# Altium project PCB_SBW_Feedback_Reg.PrjPcb
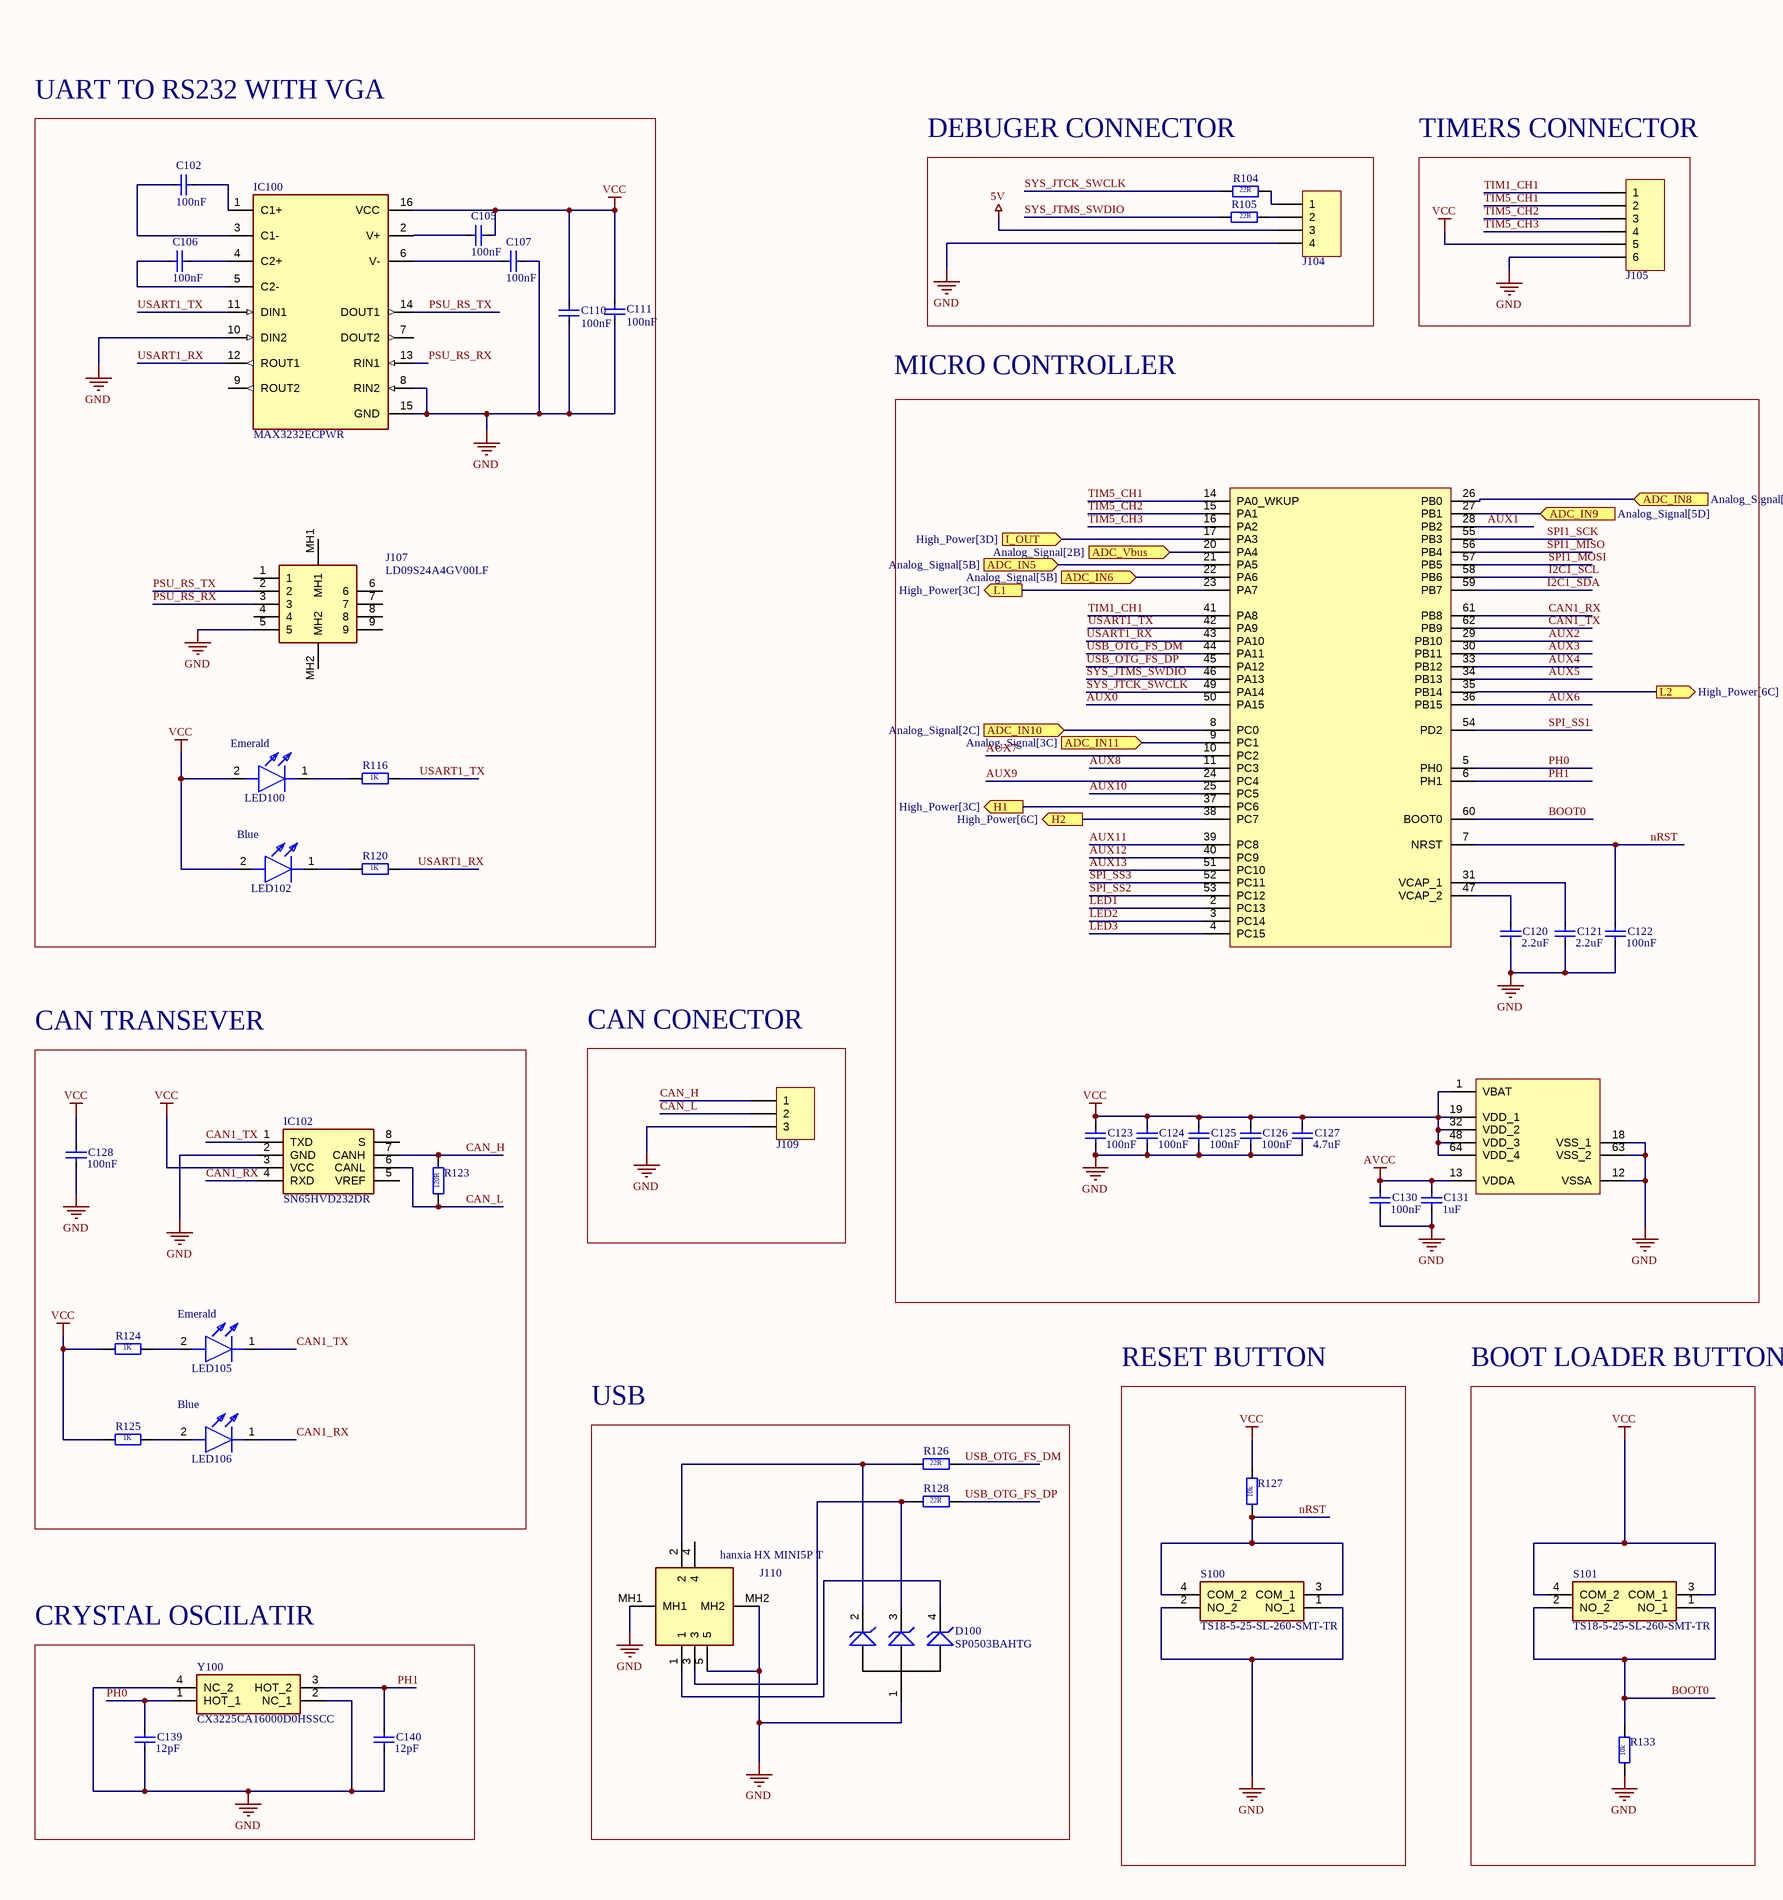
[diagram p0: Microcontroller.SchDoc, left]
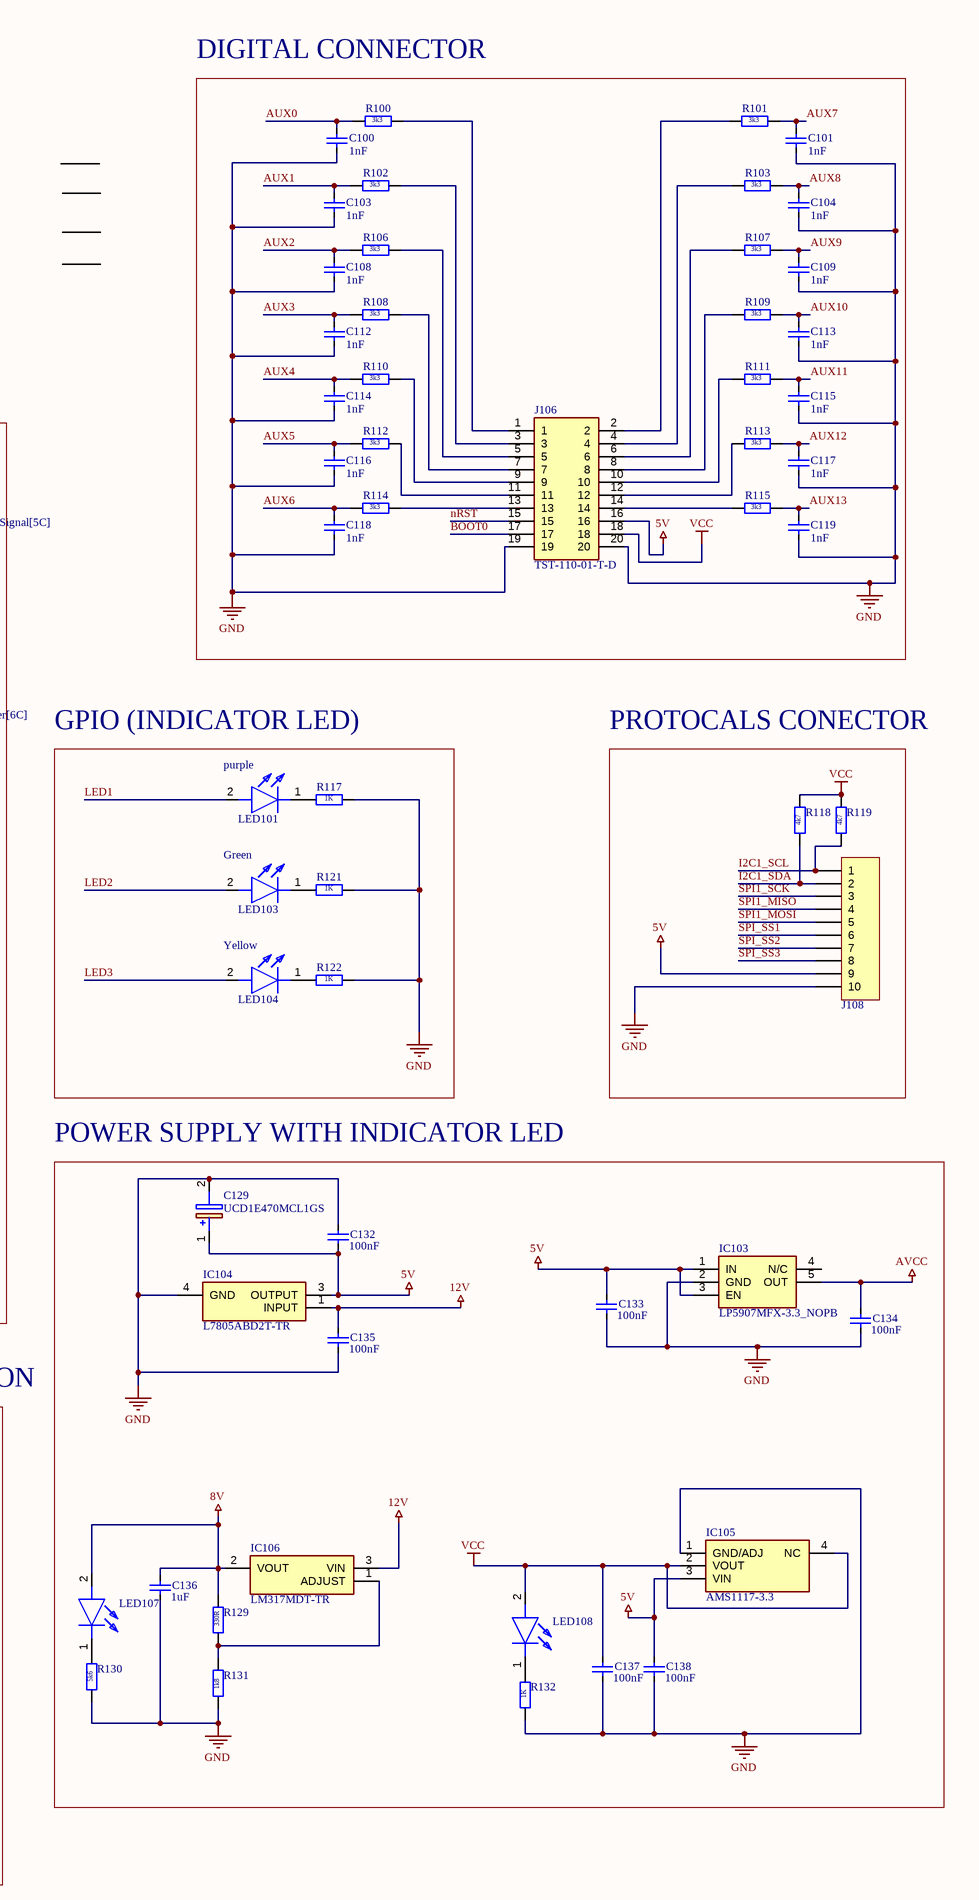
[diagram p1: Microcontroller.SchDoc, right]
3 sheets, 171 parts. Net scope: flat (ports and power ports of the same name join across sheets).
Board file: PCB_SBW_Feedback_Reg.PcbDoc
Sheets:
  Microcontroller.SchDoc
  Analog_Signal.SchDoc
  High_Power.SchDoc

## Sheet Microcontroller.SchDoc
size 594 x 420 mm; SheetNumber: 1; SheetTotal: 3

### Parts
C100  value 1nF  [CAPC1608X09N]  (hidden comment: C)
C101  value 1nF  [CAPC1608X09N]  (hidden comment: C)
C102  value 100nF  [CAPC1608X09N]  (hidden comment: C)
C103  value 1nF  [CAPC1608X09N]  (hidden comment: C)
C104  value 1nF  [CAPC1608X09N]  (hidden comment: C)
C105  value 100nF  [CAPC1608X09N]  (hidden comment: C)
C106  value 100nF  [CAPC1608X09N]  (hidden comment: C)
C107  value 100nF  [CAPC1608X09N]  (hidden comment: C)
C108  value 1nF  [CAPC1608X09N]  (hidden comment: C)
C109  value 1nF  [CAPC1608X09N]  (hidden comment: C)
C110  value 100nF  [CAPC1608X09N]  (hidden comment: C)
C111  value 100nF  [CAPC1608X09N]  (hidden comment: C)
C112  value 1nF  [CAPC1608X09N]  (hidden comment: C)
C113  value 1nF  [CAPC1608X09N]  (hidden comment: C)
C114  value 1nF  [CAPC1608X09N]  (hidden comment: C)
C115  value 1nF  [CAPC1608X09N]  (hidden comment: C)
C116  value 1nF  [CAPC1608X09N]  (hidden comment: C)
C117  value 1nF  [CAPC1608X09N]  (hidden comment: C)
C118  value 1nF  [CAPC1608X09N]  (hidden comment: C)
C119  value 1nF  [CAPC1608X09N]  (hidden comment: C)
C120  value 2.2uF  [CAPC1608X09N]  (hidden comment: C)
C121  value 2.2uF  [CAPC1608X09N]  (hidden comment: C)
C122  value 100nF  [CAPC1608X09N]  (hidden comment: C)
C123  value 100nF  [CAPC1608X09N]  (hidden comment: C)
C124  value 100nF  [CAPC1608X09N]  (hidden comment: C)
C125  value 100nF  [CAPC1608X09N]  (hidden comment: C)
C126  value 100nF  [CAPC1608X09N]  (hidden comment: C)
C127  value 4.7uF  [CAPC3216X18N]  (hidden comment: C)
C128  value 100nF  [CAPC1608X09N]  (hidden comment: C)
C129  UCD1E470MCL1GS  [CAPAE660X610N]
C130  value 100nF  [CAPC1608X09N]  (hidden comment: C)
C131  value 1uF  [CAPC1608X09N]  (hidden comment: C)
C132  value 100nF  [CAPC1608X09N]  (hidden comment: C)
C133  value 100nF  [CAPC1608X09N]  (hidden comment: C)
C134  value 100nF  [CAPC1608X09N]  (hidden comment: C)
C135  value 100nF  [CAPC1608X09N]  (hidden comment: C)
C136  value 1uF  [CAPC1608X09N]  (hidden comment: C)
C137  value 100nF  [CAPC1608X09N]  (hidden comment: C)
C138  value 100nF  [CAPC1608X09N]  (hidden comment: C)
C139  value 12pF  [CAPC1608X09N]  (hidden comment: C)
C140  value 12pF  [CAPC1608X09N]  (hidden comment: C)
D100  SP0503BAHTG  [SP0503BAHTG]
IC100  MAX3232ECPWR  [SOP65P640X120-16N]
IC101  STM32F405RGT6  [QFP50P1200X1200X160-64N]  (value not drawn)  (parts A,B of 2)
IC102  SN65HVD232DR  [SOIC127P600X175-8N]
IC103  LP5907MFX-3.3_NOPB  [SOT95P280X145-5N]
IC104  L7805ABD2T-TR  [D2PAK-STB35NF10T4]
IC105  AMS1117-3.3  [SOT229P700X180-4N]
IC106  LM317MDT-TR  [STD70N10F4]
J100  Hole  [Hole]  (value not drawn)  (no BOM)
J101  Hole  [Hole]  (value not drawn)  (no BOM)
J102  Hole  [Hole]  (value not drawn)  (no BOM)
J103  Hole  [Hole]  (value not drawn)  (no BOM)
J104  XH2.54-4P  [XH2.54-4P]  (value not drawn)
J105  XH2.54-6P  [XH2.54-6P]  (value not drawn)
J106  TST-110-01-T-D  [TST-110-XX-Y-D]
J107  LD09S24A4GV00LF  [LD09S24A4GV00LF]
J108  XH2.54-10P  [XH2.54-10P]  (value not drawn)
J109  XH2.54-3P  [XH2.54-3P]  (value not drawn)
J110  hanxia HX MINI5P T  [10119313301TLF]
LED100  Emerald  [LEDC1608X80N]
LED101  purple  [LEDC1608X80N]
LED102  Blue  [LEDC1608X80N]
LED103  Green  [LEDC1608X80N]
LED104  Yellow  [LEDC1608X80N]
LED105  Emerald  [LEDC1608X80N]
LED106  Blue  [LEDC1608X80N]
LED107  LTST-C190KGKT  [LEDC1608X80N]  (value not drawn)
LED108  LTST-C190KGKT  [LEDC1608X80N]  (value not drawn)
R100  value 3k3  [RESC1608X06N]  (hidden comment: R)
R101  value 3k3  [RESC1608X06N]  (hidden comment: R)
R102  value 3k3  [RESC1608X06N]  (hidden comment: R)
R103  value 3k3  [RESC1608X06N]  (hidden comment: R)
R104  value 22R  [RESC1608X06N]  (hidden comment: R)
R105  value 22R  [RESC1608X06N]  (hidden comment: R)
R106  value 3k3  [RESC1608X06N]  (hidden comment: R)
R107  value 3k3  [RESC1608X06N]  (hidden comment: R)
R108  value 3k3  [RESC1608X06N]  (hidden comment: R)
R109  value 3k3  [RESC1608X06N]  (hidden comment: R)
R110  value 3k3  [RESC1608X06N]  (hidden comment: R)
R111  value 3k3  [RESC1608X06N]  (hidden comment: R)
R112  value 3k3  [RESC1608X06N]  (hidden comment: R)
R113  value 3k3  [RESC1608X06N]  (hidden comment: R)
R114  value 3k3  [RESC1608X06N]  (hidden comment: R)
R115  value 3k3  [RESC1608X06N]  (hidden comment: R)
R116  value 1K  [RESC1608X06N]  (hidden comment: R)
R117  value 1K  [RESC1608X06N]  (hidden comment: R)
R118  value 4k7  [RESC3216X07N]  (hidden comment: R)
R119  value 4k7  [RESC3216X07N]  (hidden comment: R)
R120  value 1K  [RESC1608X06N]  (hidden comment: R)
R121  value 1K  [RESC1608X06N]  (hidden comment: R)
R122  value 1K  [RESC1608X06N]  (hidden comment: R)
R123  value 120R  [RESC1608X06N]  (hidden comment: R)
R124  value 1K  [RESC1608X06N]  (hidden comment: R)
R125  value 1K  [RESC1608X06N]  (hidden comment: R)
R126  value 22R  [RESC1608X06N]  (hidden comment: R)
R127  value 10k  [RESC1608X06N]  (hidden comment: R)
R128  value 22R  [RESC1608X06N]  (hidden comment: R)
R129  value 330R  [RESC1608X06N]  (hidden comment: R)
R130  value 5k6  [RESC1608X06N]  (hidden comment: R)
R131  value 1k8  [RESC1608X06N]  (hidden comment: R)
R132  value 1K  [RESC1608X06N]  (hidden comment: R)
R133  value 10k  [RESC1608X06N]  (hidden comment: R)
S100  TS18-5-25-SL-260-SMT-TR  [TS18525SL260SMTTR]
S101  TS18-5-25-SL-260-SMT-TR  [TS18525SL260SMTTR]
Y100  CX3225CA16000D0HSSCC  [CX3225CA16000D0HSSCC]

### Blocks framed on the sheet
DIGITAL CONNECTOR: C100 C101 C103 C104 C108 C109 C112-C119 J106 R100-R103 R106-R115
UART TO RS232 WITH VGA: C102 C105-C107 C110 C111 IC100 J107 LED100 LED102 R116 R120
DEBUGER CONNECTOR: J104 R104 R105
TIMERS CONNECTOR: J105
MICRO CONTROLLER: C120-C127 C130 C131 IC101
GPIO (INDICATOR LED): LED101 LED103 LED104 R117 R121 R122
PROTOCALS CONECTOR: J108 R118 R119
CAN TRANSEVER: C128 IC102 LED105 LED106 R123-R125
CAN CONECTOR: J109
POWER SUPPLY WITH INDICATOR LED: C129 C132-C138 IC103-IC106 LED107 LED108 R129-R132
RESET BUTTON: R127 S100
BOOT LOADER BUTTON: R133 S101
USB: D100 J110 R126 R128
CRYSTAL OSCILATIR: C139 C140 Y100

### Ports
ADC_IN5 (in, see Analog_Signal[5B]), ADC_IN6 (in, see Analog_Signal[5B]), ADC_IN8 (in, see Analog_Signal[5C]), ADC_IN9 (in, see Analog_Signal[5D]), ADC_IN10 (in, see Analog_Signal[2C]), ADC_IN11 (in, see Analog_Signal[3C]), ADC_Vbus (in, see Analog_Signal[2B]), H1 (out, see High_Power[3C]), H2 (out, see High_Power[6C]), I_OUT (in, see High_Power[3D]), L1 (out, see High_Power[3C]), L2 (out, see High_Power[6C])

### Nets
5V: C129.1(+) C132.1 C133.2 C138.2 IC103.1(IN) IC103.3(EN) IC104.3(OUTPUT) IC105.3(VIN) J104.3 J106.16 J108.9
8V: C136.2 IC106.2(VOUT) LED107.2(A) R129.2
12V: C135.2 IC104.1(INPUT) IC106.3(VIN)
AVCC: C130.2 C131.2 C134.2 IC101.13(VDDA) IC103.5(OUT)
GND: C100.1 C101.1 C103.1 C104.1 C107.1 C108.1 C109.1 C110.2 C111.2 C112.1 C113.1 C114.1 C115.1 C116.1 C117.1 C118.1 C119.1 C120.1 C121.1 C122.1 C123.1 C124.1 C125.1 C126.1 C127.1 C128.1 C129.2(-) C130.1 C131.1 C132.2 C133.1 C134.1 C135.1 C136.1 C137.1 C138.1 C139.1 C140.1 D100.1(COMMON_A) IC100.8(RIN2) IC100.10(DIN2) IC100.15(GND) IC101.12(VSSA) IC101.18(VSS_1) IC101.63(VSS_2) IC102.2(GND) IC103.2(GND) IC104.4(GND) IC105.1(GND/ADJ) J104.4 J105.6 J106.19 J106.20 J107.5 J108.10 J109.3 J110.5 J110.MH1 J110.MH2 R117.2 R121.2 R122.2 R130.1 R131.1 R132.1 R133.1 S100.1(NO_1) S100.2(NO_2) Y100.2(NC_1) Y100.4(NC_2)
VCC: C105.1 C110.1 C111.1 C123.2 C124.2 C125.2 C126.2 C127.2 C128.2 C137.2 IC100.16(VCC) IC101.1(VBAT) IC101.19(VDD_1) IC101.32(VDD_2) IC101.48(VDD_3) IC101.64(VDD_4) IC102.3(VCC) IC105.2(VOUT) IC105.4(NC) J105.5 J106.18 LED100.2(A) LED102.2(A) LED108.2(A) R118.2 R119.2 R124.1 R125.1 R127.2 S101.3(COM_1) S101.4(COM_2)
AUX0: C100.2 IC101.50(PA15) R100.1
AUX1: C103.2 IC101.28(PB2) R102.1
AUX2: C108.2 IC101.29(PB10) R106.1
AUX3: C112.2 IC101.30(PB11) R108.1
AUX4: C114.2 IC101.33(PB12) R110.1
AUX5: C116.2 IC101.34(PB13) R112.1
AUX6: C118.2 IC101.36(PB15) R114.1
AUX7: C101.2 IC101.10(PC2) R101.1
AUX8: C104.2 IC101.11(PC3) R103.1
AUX9: C109.2 IC101.24(PC4) R107.1
AUX10: C113.2 IC101.25(PC5) R109.1
AUX11: C115.2 IC101.39(PC8) R111.1
AUX12: C117.2 IC101.40(PC9) R113.1
AUX13: C119.2 IC101.51(PC10) R115.1
BOOT0: IC101.60(BOOT0) J106.17 R133.2 S101.1(NO_1) S101.2(NO_2)
CAN1_RX: IC101.61(PB8) IC102.4(RXD) LED106.1(K)
CAN1_TX: IC101.62(PB9) IC102.1(TXD) LED105.1(K)
CAN_H: IC102.7(CANH) J109.1 R123.2
CAN_L: IC102.6(CANL) J109.2 R123.1
I2C1_SCL: IC101.58(PB6) J108.1 R119.1
I2C1_SDA: IC101.59(PB7) J108.2 R118.1
LED1: IC101.2(PC13) LED101.2(A)
LED2: IC101.3(PC14) LED103.2(A)
LED3: IC101.4(PC15) LED104.2(A)
nRST: C122.2 IC101.7(NRST) J106.15 R127.1 S100.3(COM_1) S100.4(COM_2)
PH0: C139.2 IC101.5(PH0) Y100.1(HOT_1)
PH1: C140.2 IC101.6(PH1) Y100.3(HOT_2)
PSU_RS_RX: IC100.13(RIN1) J107.3
PSU_RS_TX: IC100.14(DOUT1) J107.2
SPI1_MISO: IC101.56(PB4) J108.4
SPI1_MOSI: IC101.57(PB5) J108.5
SPI1_SCK: IC101.55(PB3) J108.3
SPI_SS1: IC101.54(PD2) J108.6
SPI_SS2: IC101.53(PC12) J108.7
SPI_SS3: IC101.52(PC11) J108.8
SYS_JTCK_SWCLK: IC101.49(PA14) R104.1
SYS_JTMS_SWDIO: IC101.46(PA13) R105.1
TIM1_CH1: IC101.41(PA8) J105.1
TIM5_CH1: IC101.14(PA0_WKUP) J105.2
TIM5_CH2: IC101.15(PA1) J105.3
TIM5_CH3: IC101.16(PA2) J105.4
USART1_RX: IC100.12(ROUT1) IC101.43(PA10) R120.2
USART1_TX: IC100.11(DIN1) IC101.42(PA9) R116.2
USB_OTG_FS_DM: IC101.44(PA11) R126.2
USB_OTG_FS_DP: IC101.45(PA12) R128.2
NetC102_1: C102.1 IC100.1(C1+)
NetC102_2: C102.2 IC100.3(C1-)
NetC105_2: C105.2 IC100.2(V+)
NetC106_1: C106.1 IC100.4(C2+)
NetC106_2: C106.2 IC100.5(C2-)
NetC107_2: C107.2 IC100.6(V-)
NetC120_2: C120.2 IC101.47(VCAP_2)
NetC121_2: C121.2 IC101.31(VCAP_1)
NetC200_2: IC101.20(PA4) ; port ADC_Vbus
NetC205_2: IC101.8(PC0) ; port ADC_IN10
NetC206_2: IC101.9(PC1) ; port ADC_IN11
NetC309_1: IC101.17(PA3) ; port I_OUT
NetD100_2: D100.2(K_1) J110.2 R126.1
NetD100_3: D100.3(K_2) J110.3 R128.1
NetD100_4: D100.4(K_3) J110.1
NetIC101_21: IC101.21(PA5) ; port ADC_IN5
NetIC101_22: IC101.22(PA6) ; port ADC_IN6
NetIC101_23: IC101.23(PA7) ; port L1
NetIC101_26: IC101.26(PB0) ; port ADC_IN8
NetIC101_27: IC101.27(PB1) ; port ADC_IN9
NetIC101_35: IC101.35(PB14) ; port L2
NetIC101_37: IC101.37(PC6) ; port H1
NetIC101_38: IC101.38(PC7) ; port H2
NetIC106_1: IC106.1(ADJUST) R129.1 R131.2
NetJ104_1: J104.1 R104.2
NetJ104_2: J104.2 R105.2
NetJ106_1: J106.1 R100.2
NetJ106_2: J106.2 R101.2
NetJ106_3: J106.3 R102.2
NetJ106_4: J106.4 R103.2
NetJ106_5: J106.5 R106.2
NetJ106_6: J106.6 R107.2
NetJ106_7: J106.7 R108.2
NetJ106_8: J106.8 R109.2
NetJ106_9: J106.9 R110.2
NetJ106_10: J106.10 R111.2
NetJ106_11: J106.11 R112.2
NetJ106_12: J106.12 R113.2
NetJ106_13: J106.13 R114.2
NetJ106_14: J106.14 R115.2
NetLED100_1: LED100.1(K) R116.1
NetLED101_1: LED101.1(K) R117.1
NetLED102_1: LED102.1(K) R120.1
NetLED103_1: LED103.1(K) R121.1
NetLED104_1: LED104.1(K) R122.1
NetLED105_2: LED105.2(A) R124.2
NetLED106_2: LED106.2(A) R125.2
NetLED107_1: LED107.1(K) R130.2
NetLED108_1: LED108.1(K) R132.2

Not connected (* = marked no-connect by the designer): IC100 7(DOUT2) 9(ROUT2); IC102 5(VREF) 8(S); IC103 4(N/C); J100 J?(0); J101 J?(0); J102 J?(0); J103 J?(0); J107 1 4 6 7 8 9 MH1 MH2; J110 4

### Notes on the sheet
- DWG NO:
- REV:
- THIS DOCUMENT AND THE DATA DISCLOSED HEREIN OR
- HEREWITH IS THE PROPERTY OF ALTIUM LIMITED AND MAY
- BE FREELY DISTRIBUTED IN WHOLE. NO RIGHTS ARE
- RESERVED OR EXPRESS OR IMPLIED WARANTEE GIVEN.
- REVISION
- DESCRIPTION
- DATE
- APPROVED
- ENG:
- APPROVALS
- PROJECT
- DSN:
- CHK:
- REFERENCE DOCUMENTS
- PROJECT REVISION:
- TITLE
- DOCUMENT REVISION:
- DESIGN ITEM:
- BOM:
- FAB DWG:
- PCB DWG:
- ASSY DWG:
- SCALE:
- A2
- SIZE
- CAGE CODE
- FILE NAME
- DWG NO.
- SHEET
- OF
- REV

### Library data of the parts
C100 C101 C103 C104 C108 C109 C112-C119 = C: MPN: CC0603KRX7R9BB102; Link: https://www.lcsc.com/product-detail/Multilayer-Ceramic-Capacitors-MLCC-SMD-SMT_YAGEO-CC0603KRX7R9BB102_C100040.html?s_z=n_CC0603KRX7R9BB102
C102 C105-C107 C110 C111 C122-C126 C128 C130 C132-C135 C137 C138 = C: MPN: 06033C104KAT4A; Link: https://www.lcsc.com/product-detail/Multilayer-Ceramic-Capacitors-MLCC-SMD-SMT_Kyocera-AVX-06033C104KAT4A_C2167104.html
C120 C121 = C: MPN: 0603B225K250NT; Link: https://www.lcsc.com/product-detail/Multilayer-Ceramic-Capacitors-MLCC-SMD-SMT_FH-Guangdong-Fenghua-Advanced-Tech-0603B225K250NT_C99228.html?s_z=n_0603B225K250NT
C127 = C: MPN: CS3216X7R475K160NRI; Link: https://www.lcsc.com/search?q=CS3216X7R475K160NRI&s_z=n_CS3216X7R475K160NRI
C129 = UCD1E470MCL1GS: Capacitor Polarised; Manufacturer_Name: Nichicon; Datasheet Link: https://www.lcsc.com/datasheet/lcsc_datasheet_2410121340_Nichicon-UCD1E470MCL1GS_C308827.pdf; Height: 6.1mm; MPN: UCD1E470MCL1GS; LCSC Part Number: C308827; LCSC Price/Stock: https://www.lcsc.com/product-detail/Aluminum-Electrolytic-Capacitors-SMD_Nichicon-UCD1E470MCL1GS_C308827.html?s_z=n_UCD1E470MCL1GS; Arrow Part Number: UCD1E470MCL1GS; Link: https://www.lcsc.com/product-detail/Aluminum-Electrolytic-Capacitors-SMD_Nichicon-UCD1E470MCL1GS_C308827.html?s_z=n_UCD1E470MCL1GS
C131 C136 = C: MPN: CL10B105KP8NNNC; Link: https://www.lcsc.com/search?q=CL10B105KP8NNNC&s_z=n_CL10B105KP8NNNC
C139 C140 = C: MPN: CL10C120JB8NNNC; Link: https://www.lcsc.com/product-detail/Multilayer-Ceramic-Capacitors-MLCC-SMD-SMT_Samsung-Electro-Mechanics-CL10C120JB8NNNC_C38523.html
D100 = SP0503BAHTG: TVS Diode (Uni-directional); Manufacturer_Name: GOODWORK; Datasheet Link: https://nl.mouser.com/datasheet/2/240/Littelfuse_TVS_Diode_Array_SP05_Datasheet.pdf-777043.pdf; Height: 1.22mm; MPN: SP0503BAHTG; LCSC Part Number: C41364459; LCSC Price/Stock: https://www.lcsc.com/product-detail/ESD-and-Surge-Protection-TVS-ESD_GOODWORK-SP0503BAHTG_C41364459.html?s_z=n_SP0503BAHTG; Arrow Part Number: SP0503BAHTG; Link: https://www.lcsc.com/product-detail/ESD-and-Surge-Protection-TVS-ESD_GOODWORK-SP0503BAHTG_C41364459.html?s_z=n_SP0503BAHTG
IC100 = MAX3232ECPWR: Integrated Circuit; Manufacturer_Name: Texas Instruments; Datasheet Link: http://www.ti.com/general/docs/lit/getliterature.tsp?genericPartNumber=MAX3232E&fileType=pdf&HQS=ti-null-null-sf-df-pf-sep-wwe&DCM=yes; Height: 1.2mm; MPN: MAX3232ECPWR; LCSC Part Number: C11317; LCSC Price/Stock: https://www.lcsc.com/product-detail/RS232-ICs_Texas-Instruments-MAX3232ECPWR_C11317.html?s_z=n_MAX3232ECPWR; Arrow Part Number: MAX3232ECPWR; Link: https://www.lcsc.com/product-detail/RS232-ICs_Texas-Instruments-MAX3232ECPWR_C11317.html?s_z=n_MAX3232ECPWR
IC101 = STM32F405RGT6: Integrated Circuit; Manufacturer_Name: STMicroelectronics; Datasheet Link: http://www.st.com/web/en/resource/technical/document/datasheet/DM00037051.pdf; Height: 1.6mm; MPN: STM32F405RGT6; LCSC Part Number: C15742; LCSC Price/Stock: https://www.lcsc.com/product-detail/Microcontrollers-MCU-MPU-SOC_STMicroelectronics-STM32F405RGT6_C15742.html?s_z=n_Stm32f405rg; Arrow Part Number: STM32F405RGT6; Link: https://www.lcsc.com/product-detail/Microcontrollers-MCU-MPU-SOC_STMicroelectronics-STM32F405RGT6_C15742.html?s_z=n_Stm32f405rg
IC102 = TJA1050T_CM: Integrated Circuit; Manufacturer_Name: NXP; Datasheet Link: https://www.lcsc.com/datasheet/lcsc_datasheet_2410010302_Texas-Instruments-SN65HVD232DR_C30530.pdf; Height: 1.75mm; MPN: SN65HVD232DR; LCSC Part Number: C30530; LCSC Price/Stock: https://www.lcsc.com/product-detail/CAN-Transceivers_Texas-Instruments-SN65HVD232DR_C30530.html?s_z=n_SN65HVD232DR; Link: https://www.lcsc.com/product-detail/CAN-Transceivers_Texas-Instruments-SN65HVD232DR_C30530.html?s_z=n_SN65HVD232DR
IC103 = LP5907MFX-3.3_NOPB: Integrated Circuit; Manufacturer_Name: Texas Instruments; MPN: LP5907MFX-3.3/NOPB; Datasheet Link: https://www.lcsc.com/datasheet/lcsc_datasheet_1810271029_Texas-Instruments-LP5907MFX-3-3-NOPB_C80670.pdf; Height: 1.45mm; LCSC Part Number: C80670; LCSC Price/Stock: https://www.lcsc.com/product-detail/Voltage-Regulators-Linear-Low-Drop-Out-LDO-Regulators_Texas-Instruments-LP5907MFX-3-3-NOPB_C80670.html?s_z=n_LP5907MFX-3.3%2FNOPB; Arrow Part Number: LP5907MFX-3.3/NOPB; Link: https://www.lcsc.com/product-detail/Voltage-Regulators-Linear-Low-Drop-Out-LDO-Regulators_Texas-Instruments-LP5907MFX-3-3-NOPB_C80670.html?s_z=n_LP5907MFX-3.3%2FNOPB
IC104 = L7805ABD2T-TR: Integrated Circuit; Manufacturer_Name: STMicroelectronics; Datasheet Link: https://www.lcsc.com/datasheet/lcsc_datasheet_2212141130_STMicroelectronics-L7805ABD2T-TR_C86206.pdf; MPN: L7805ABD2T-TR; LCSC Part Number: C86206; LCSC Price/Stock: https://www.lcsc.com/product-detail/Voltage-Regulators-Linear-Low-Drop-Out-LDO-Regulators_STMicroelectronics-L7805ABD2T-TR_C86206.html?s_z=n_L7805ABD2T-TR; Arrow Part Number: L7805ABD2T-TR; Link: https://www.lcsc.com/product-detail/Voltage-Regulators-Linear-Low-Drop-Out-LDO-Regulators_STMicroelectronics-L7805ABD2T-TR_C86206.html?s_z=n_L7805ABD2T-TR
IC105 = AMS1117-3.3: Integrated Circuit; Manufacturer_Name: Advanced; Datasheet Link: https://www.lcsc.com/datasheet/lcsc_datasheet_2412201207_UMW-Youtai-Semiconductor-Co---Ltd--AMS1117-3-3_C347222.pdf; Height: 1.8mm; MPN: AMS1117-3.3; LCSC Part Number: C347222; LCSC Price/Stock: https://www.lcsc.com/product-detail/Voltage-Regulators-Linear-Low-Drop-Out-LDO-Regulators_UMW-Youtai-Semiconductor-Co-Ltd-AMS1117-3-3_C347222.html?s_z=n_AMS1117-3.3; Link: https://www.lcsc.com/product-detail/Voltage-Regulators-Linear-Low-Drop-Out-LDO-Regulators_UMW-Youtai-Semiconductor-Co-Ltd-AMS1117-3-3_C347222.html?s_z=n_AMS1117-3.3
IC106 = LM317MDT-TR: Integrated Circuit; Manufacturer_Name: STMicroelectronics; Datasheet Link: https://www.lcsc.com/datasheet/lcsc_datasheet_1811151523_STMicroelectronics-LM317MDT-TR_C68136.pdf; Height: 2.4mm; MPN: LM317MDT-TR; LCSC Part Number: C68136; LCSC Price/Stock: https://www.lcsc.com/product-detail/Voltage-Regulators-Linear-Low-Drop-Out-LDO-Regulators_STMicroelectronics-LM317MDT-TR_C68136.html?s_z=n_lm317; Arrow Part Number: LM317MDT-TR; Arrow Price/Stock: https://www.arrow.com/en/products/lm317mdt-tr/stmicroelectronics?utm_currency=USD&region=nac; Link: https://www.lcsc.com/product-detail/Voltage-Regulators-Linear-Low-Drop-Out-LDO-Regulators_STMicroelectronics-LM317MDT-TR_C68136.html?s_z=n_lm317
J104 = XH2.54-4P: MPN: BX-XH2.54-4PZZ; Link: https://www.lcsc.com/product-detail/Wire-To-Board-Connector_Bossie-BX-XH2-54-4PZZ_C18077835.html?s_z=n_BX-XH2.54-4PZZ
J105 = XH2.54-6P: MPN: BX-XH2.54-6PZZ; Link: https://www.lcsc.com/product-detail/Wire-To-Board-Connector_Bossie-BX-XH2-54-6PZZ_C18077837.html?s_z=n_BX-XH2.54-6PZZ
J106 = TST-110-01-T-D: Connector; Manufacturer_Name: SAMTEC; MPN: BH254V-20P; Datasheet Link: http://suddendocs.samtec.com/prints/tst-1xx-xx-x-x-xx-xx-mkt.pdf; LCSC Part Number: C492444; LCSC Price/Stock: https://www.lcsc.com/product-detail/IDC-Connectors_XFCN-BH254V-20P_C492444.html; Arrow Part Number: TST-110-01-T-D; Link: https://www.lcsc.com/product-detail/IDC-Connectors_XFCN-BH254V-20P_C492444.html
J107 = LD09S24A4GV00LF: Connector; Manufacturer_Name: Amphenol Communications Solutions; MPN: DS1034-09FUNSi44; Datasheet Link: https://www.lcsc.com/datasheet/lcsc_datasheet_2501031530_CONNFLY-Elec-DS1034-09FUNSi44_C77831.pdf; Height: 12.39mm; LCSC Part Number: C77831; Arrow Part Number: LD09S24A4GV00LF; Link: https://www.lcsc.com/product-detail/D-Sub-VGA-Connectors_CONNFLY-Elec-DS1034-09FUNSi44_C77831.html
J108 = XH2.54-10P: MPN: BX-XH2.54-10PZZ; Link: https://www.lcsc.com/product-detail/Wire-To-Board-Connector_Bossie-BX-XH2-54-10PZZ_C18077841.html?s_z=n_XH2.54-10P
J109 = XH2.54-3P: MPN: BX-XH2.54-3PZZ; Link: https://www.lcsc.com/product-detail/Wire-To-Board-Connector_Bossie-BX-XH2-54-3PZZ_C18077834.html?s_z=n_BX-XH2.54-3PZZ
J110 = 10119313-301TLF: Connector; Datasheet Link: https://www.lcsc.com/datasheet/lcsc_datasheet_2311032126_hanxia-HX-MINI5P-T_C19189146.pdf; Height: 9.7mm; Manufacturer_Name: hanxia; MPN: HX MINI5P T; LCSC Part Number: C19189146; LCSC Price/Stock: https://www.lcsc.com/product-detail/USB-Connectors_hanxia-HX-MINI5P-T_C19189146.html; Link: https://www.lcsc.com/product-detail/USB-Connectors_hanxia-HX-MINI5P-T_C19189146.html
LED100 LED105 = LTST-C190KGKT: LED; Manufacturer_Name: Lite-On; MPN: XL-1608UGC-04; Datasheet Link: https://www.lcsc.com/datasheet/lcsc_datasheet_2410121310_XINGLIGHT-XL-1608UGC-04_C965804.pdf; Height: 0.8mm; LCSC Part Number: C965804; LCSC Price/Stock: https://www.lcsc.com/product-detail/LED-Indication-Discrete_XINGLIGHT-XL-1608UGC-04_C965804.html; Arrow Part Number: LTST-C190KGKT; Arrow Price/Stock: https://www.arrow.com/en/products/ltst-c190kgkt/lite-on-technology?region=europe; Link: https://www.lcsc.com/product-detail/LED-Indication-Discrete_XINGLIGHT-XL-1608UGC-04_C965804.html
LED101 = LTST-C190KGKT: LED; Manufacturer_Name: XINGLIGHT; MPN: XL-1608UVC-04; Datasheet Link: https://www.lcsc.com/datasheet/lcsc_datasheet_2410121441_XINGLIGHT-XL-1608UVC-04_C7371898.pdf; Height: 0.8mm; Lcsc Part Number: C7371898; Lcsc Price/Stock: https://www.lcsc.com/product-detail/LED-Indication-Discrete_XINGLIGHT-XL-1608UVC-04_C7371898.html; Arrow Part Number: LTST-C190KGKT; Link: https://www.lcsc.com/product-detail/LED-Indication-Discrete_XINGLIGHT-XL-1608UVC-04_C7371898.html
LED102 LED106 = LTST-C190KGKT: LED; Manufacturer_Name: Lite-On; MPN: XL-1608UBC-04; Datasheet Link: https://www.lcsc.com/datasheet/lcsc_datasheet_2410121310_XINGLIGHT-XL-1608UBC-04_C965807.pdf; Height: 0.8mm; LCSC Part Number: C965807; LCSC Price/Stock: https://www.lcsc.com/product-detail/LED-Indication-Discrete_XINGLIGHT-XL-1608UBC-04_C965807.html; Arrow Part Number: LTST-C190KGKT; Arrow Price/Stock: https://www.arrow.com/en/products/ltst-c190kgkt/lite-on-technology?region=europe; Link: https://www.lcsc.com/product-detail/LED-Indication-Discrete_XINGLIGHT-XL-1608UBC-04_C965807.html
LED103 = LTST-C190KGKT: LED; Manufacturer_Name: XINGLIGHT; MPN: XL-1608BGWC-06; Datasheet Link: https://www.lcsc.com/datasheet/lcsc_datasheet_2410121258_XINGLIGHT-XL-1608BGWC-06_C965809.pdf; Height: 0.8mm; Lcsc Part Number: C965809; Lcsc Price/Stock: https://www.lcsc.com/product-detail/LED-Indication-Discrete_XINGLIGHT-XL-1608BGWC-06_C965809.html; Arrow Part Number: LTST-C190KGKT; Arrow Price/Stock: https://www.arrow.com/en/products/ltst-c190kgkt/lite-on-technology?region=europe; Link: https://www.lcsc.com/product-detail/LED-Indication-Discrete_XINGLIGHT-XL-1608BGWC-06_C965809.html
LED104 = LTST-C190KGKT: LED; Manufacturer_Name: XINGLIGHT; MPN: XL-1608WYC-06; Datasheet Link: https://www.lcsc.com/datasheet/lcsc_datasheet_2410121258_XINGLIGHT-XL-1608WYC-06_C7371907.pdf; Height: 0.8mm; Lcsc Part Number: C7371907; Lcsc Price/Stock: https://www.lcsc.com/product-detail/LED-Indication-Discrete_XINGLIGHT-XL-1608WYC-06_C7371907.html; Arrow Part Number: LTST-C190KGKT; Arrow Price/Stock: https://www.arrow.com/en/products/ltst-c190kgkt/lite-on-technology?region=europe; Link: https://www.lcsc.com/product-detail/LED-Indication-Discrete_XINGLIGHT-XL-1608WYC-06_C7371907.html
LED107 LED108 = LTST-C190KGKT: LED; Manufacturer_Name: XINGLIGHT; MPN: XL-1608SURC-06; Datasheet Link: https://www.lcsc.com/datasheet/lcsc_datasheet_2402181505_XINGLIGHT-XL-1608SURC-06_C965799.pdf; Height: 0.8mm; LCSC Part Number: C965799; LCSC Price/Stock: https://www.lcsc.com/product-detail/LED-Indication-Discrete_XINGLIGHT-XL-1608SURC-06_C965799.html; Arrow Part Number: LTST-C190KGKT; Arrow Price/Stock: https://www.arrow.com/en/products/ltst-c190kgkt/lite-on-technology?region=europe; Link: https://www.lcsc.com/product-detail/LED-Indication-Discrete_XINGLIGHT-XL-1608SURC-06_C965799.html
R100-R103 R106-R115 = R: MPN: 0603WAF3301T5E; Link: https://www.lcsc.com/product-detail/Chip-Resistor-Surface-Mount_UNI-ROYAL-Uniroyal-Elec-0603WAF3301T5E_C22978.html?s_z=n_0603WAF3301T5E
R104 R105 R126 R128 = R: MPN: 0603WAF220JT5E
  R104 R105: Link: https://www.lcsc.com/product-detail/Chip-Resistor-Surface-Mount_UNI-ROYAL-Uniroyal-Elec-0603WAF220JT5E_C23345.html?s_z=n_0603WAF220JT5E
  R126 R128: Link: https://www.lcsc.com/product-detail/Chip-Resistor-Surface-Mount_UNI-ROYAL-Uniroyal-Elec-0603WAF220JT5E_C23345.html
R116 R117 R120-R122 R124 R125 R132 = R: MPN: 0603WAF1001T5E; Link: https://www.lcsc.com/product-detail/Chip-Resistor-Surface-Mount_UNI-ROYAL-Uniroyal-Elec-0603WAF1001T5E_C21190.html
R118 R119 = R: MPN: RC0603FR-074K7L; Link: https://www.lcsc.com/product-detail/Chip-Resistor-Surface-Mount_YAGEO-RC0603FR-074K7L_C99782.html
R123 = R: MPN: 0603WAF1200T5E; Link: https://www.lcsc.com/product-detail/Chip-Resistor-Surface-Mount_UNI-ROYAL-Uniroyal-Elec-0603WAF1200T5E_C22787.html
R127 R133 = R: MPN: RC0603FR-0710KL; Link: https://www.lcsc.com/product-detail/Chip-Resistor-Surface-Mount_YAGEO-RC0603FR-0710KL_C98220.html
R129 = R: MPN: 0805W8F3300T5E; Link: https://www.lcsc.com/product-detail/Chip-Resistor-Surface-Mount_UNI-ROYAL-Uniroyal-Elec-0805W8F3300T5E_C17630.html?s_z=n_resistor
R130 = R: MPN: 0603WAF5601T5E; Link: https://www.lcsc.com/product-detail/Chip-Resistor-Surface-Mount_UNI-ROYAL-Uniroyal-Elec-0603WAF5601T5E_C23189.html
R131 = R: MPN: 0603WAF1801T5E; Link: https://www.lcsc.com/product-detail/Chip-Resistor-Surface-Mount_YAGEO-RC0603FR-0710KL_C98220.html
S100 S101 = TS18-5-25-SL-260-SMT-TR: Switch; Manufacturer_Name: G-Switch; MPN: GT-TC084B-H015-L5; Datasheet Link: https://www.lcsc.com/datasheet/lcsc_datasheet_2412091245_G-Switch-GT-TC084B-H015-L5_C778173.pdf; Height: 2.7mm; LCSC Part Number: C778173; LCSC Price/Stock: https://www.lcsc.com/product-detail/Tactile-Switches_G-Switch-GT-TC084B-H015-L5_C778173.html; Link: https://www.lcsc.com/product-detail/Tactile-Switches_G-Switch-GT-TC084B-H015-L5_C778173.html
Y100 = CX3225CA16000D0HSSCC: Crystal or Oscillator; Manufacturer_Name: YXC Crystal Oscillators; MPN: XL2EL89COI-111YLC-8M; Datasheet Link: https://www.lcsc.com/datasheet/lcsc_datasheet_2411121006_YXC-Crystal-Oscillators-XL2EL89COI-111YLC-8M_C2973805.pdf; Height: 0.9mm; LCSC Part Number: C2973805; LCSC Price/Stock: https://www.lcsc.com/product-detail/Crystals_YXC-Crystal-Oscillators-XL2EL89COI-111YLC-8M_C2973805.html; Arrow Part Number: CX3225CA16000D0HSSCC; Link: https://www.lcsc.com/product-detail/Crystals_YXC-Crystal-Oscillators-XL2EL89COI-111YLC-8M_C2973805.html
J100-J103 = Hole: Parameter 1: *

## Sheet Analog_Signal.SchDoc
size 594 x 420 mm; SheetNumber: 2; SheetTotal: 3
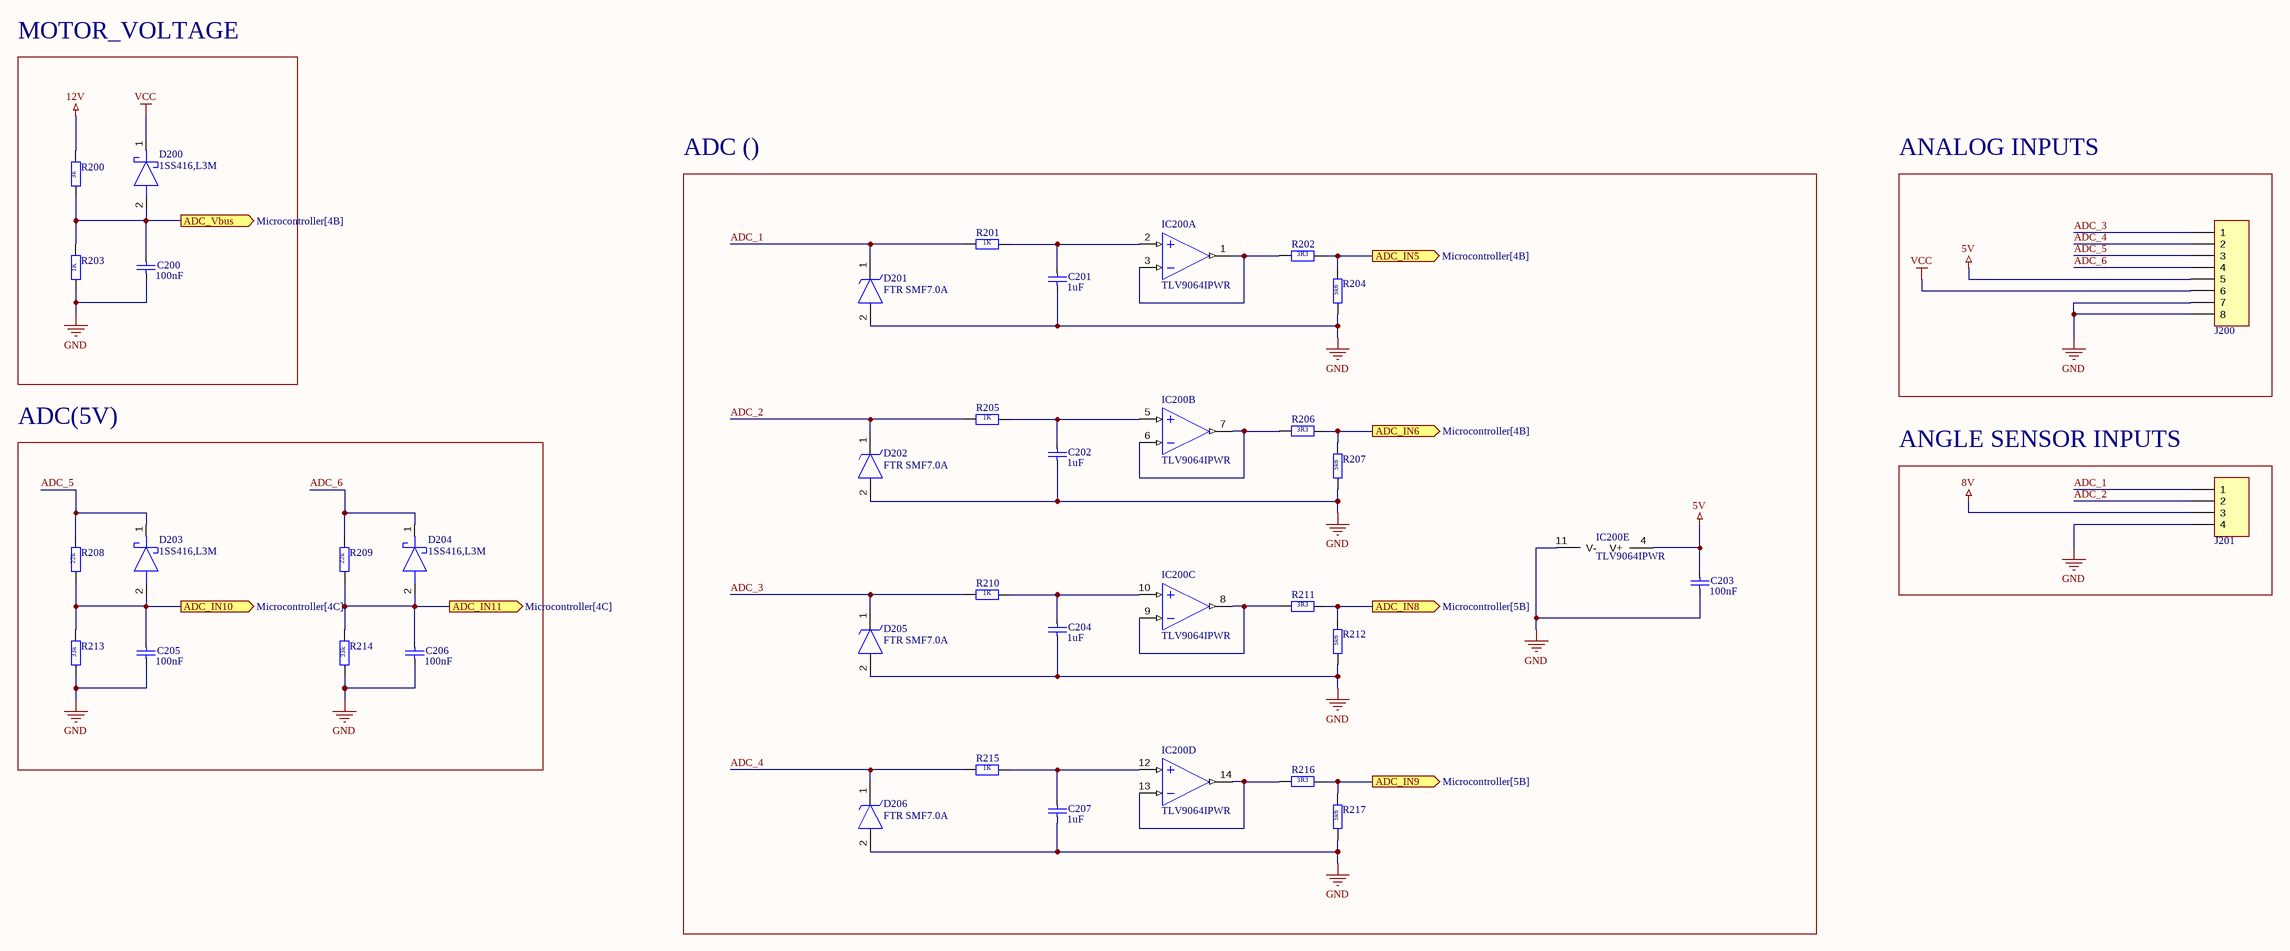
[diagram p2: Analog_Signal.SchDoc]

### Parts
C200  value 100nF  [CAPC1608X09N]  (hidden comment: C)
C201  value 1uF  [CAPC1608X09N]  (hidden comment: C)
C202  value 1uF  [CAPC1608X09N]  (hidden comment: C)
C203  value 100nF  [CAPC1608X09N]  (hidden comment: C)
C204  value 1uF  [CAPC1608X09N]  (hidden comment: C)
C205  value 100nF  [CAPC1608X09N]  (hidden comment: C)
C206  value 100nF  [CAPC1608X09N]  (hidden comment: C)
C207  value 1uF  [CAPC1608X09N]  (hidden comment: C)
D200  1SS416,L3M  [SODFL1006X45N]
D201  FTR SMF7.0A  [SMF70ATP]
D202  FTR SMF7.0A  [SMF70ATP]
D203  1SS416,L3M  [SODFL1006X45N]
D204  1SS416,L3M  [SODFL1006X45N]
D205  FTR SMF7.0A  [SMF70ATP]
D206  FTR SMF7.0A  [SMF70ATP]
IC200  TLV9064IPWR  [SOP65P640X120-14N]  (parts A,B,C,D,E of 5)
J200  XH2.54-8P  [XH2.54-8P]  (value not drawn)
J201  XH2.54-4P  [XH2.54-4P]  (value not drawn)
R200  value 3k  [RESC1608X06N]  (hidden comment: R)
R201  value 1K  [RESC1608X06N]  (hidden comment: R)
R202  value 3R3  [RESC1608X06N]  (hidden comment: R)
R203  value 1K  [RESC1608X06N]  (hidden comment: R)
R204  value 5k6  [RESC1608X06N]  (hidden comment: R)
R205  value 1K  [RESC1608X06N]  (hidden comment: R)
R206  value 3R3  [RESC1608X06N]  (hidden comment: R)
R207  value 5k6  [RESC1608X06N]  (hidden comment: R)
R208  value 22k  [RESC1608X06N]  (hidden comment: R)
R209  value 22k  [RESC1608X06N]  (hidden comment: R)
R210  value 1K  [RESC1608X06N]  (hidden comment: R)
R211  value 3R3  [RESC1608X06N]  (hidden comment: R)
R212  value 5k6  [RESC1608X06N]  (hidden comment: R)
R213  value 33k  [RESC1608X06N]  (hidden comment: R)
R214  value 33k  [RESC1608X06N]  (hidden comment: R)
R215  value 1K  [RESC1608X06N]  (hidden comment: R)
R216  value 3R3  [RESC1608X06N]  (hidden comment: R)
R217  value 5k6  [RESC1608X06N]  (hidden comment: R)

### Blocks framed on the sheet
MOTOR_VOLTAGE: C200 D200 R200 R203
ADC (): C201-C204 C207 D201 D202 D205 D206 IC200 R201 R202 R204-R207 R210-R212 R215-R217
ANALOG INPUTS: J200
ADC(5V): C205 C206 D203 D204 R208 R209 R213 R214
ANGLE SENSOR INPUTS: J201

### Ports
ADC_IN5 (out, see Microcontroller[4B]), ADC_IN6 (out, see Microcontroller[4B]), ADC_IN8 (out, see Microcontroller[5B]), ADC_IN9 (out, see Microcontroller[5B]), ADC_IN10 (out, see Microcontroller[4C]), ADC_IN11 (out, see Microcontroller[4C]), ADC_Vbus (out, see Microcontroller[4B])

### Nets
5V: C203.2 IC200.4(V+) J200.5
8V: J201.3
12V: R200.2
GND: C200.1 C201.1 C202.1 C203.1 C204.1 C205.1 C206.1 C207.1 D201.2(A) D202.2(A) D205.2(A) D206.2(A) IC200.11(V-) J200.7 J200.8 J201.4 R203.1 R204.1 R207.1 R212.1 R213.1 R214.1 R217.1
VCC: D200.1(K) J200.6
ADC_1: D201.1(K) J201.1 R201.2
ADC_2: D202.1(K) J201.2 R205.2
ADC_3: D205.1(K) J200.1 R210.2
ADC_4: D206.1(K) J200.2 R215.2
ADC_5: D203.1(K) J200.3 R208.2
ADC_6: D204.1(K) J200.4 R209.2
NetC200_2: C200.2 D200.2(A) R200.1 R203.2 ; port ADC_Vbus
NetC201_2: C201.2 IC200.2(IN1-) R201.1
NetC202_2: C202.2 IC200.5(IN2+) R205.1
NetC204_2: C204.2 IC200.10(IN3+) R210.1
NetC205_2: C205.2 D203.2(A) R208.1 R213.2 ; port ADC_IN10
NetC206_2: C206.2 D204.2(A) R209.1 R214.2 ; port ADC_IN11
NetC207_2: C207.2 IC200.12(IN4+) R215.1
NetIC101_21: R202.1 R204.2 ; port ADC_IN5
NetIC101_22: R206.1 R207.2 ; port ADC_IN6
NetIC101_26: R211.1 R212.2 ; port ADC_IN8
NetIC101_27: R216.1 R217.2 ; port ADC_IN9
NetIC200_1: IC200.1(OUT1) IC200.3(IN1+) R202.2
NetIC200_6: IC200.6(IN2-) IC200.7(OUT2) R206.2
NetIC200_8: IC200.8(OUT3) IC200.9(IN3-) R211.2
NetIC200_13: IC200.13(IN4-) IC200.14(OUT4) R216.2

### Notes on the sheet
- DWG NO:
- REV:
- THIS DOCUMENT AND THE DATA DISCLOSED HEREIN OR
- HEREWITH IS THE PROPERTY OF ALTIUM LIMITED AND MAY
- BE FREELY DISTRIBUTED IN WHOLE. NO RIGHTS ARE
- RESERVED OR EXPRESS OR IMPLIED WARANTEE GIVEN.
- REVISION
- DESCRIPTION
- DATE
- APPROVED
- ENG:
- APPROVALS
- PROJECT
- DSN:
- CHK:
- REFERENCE DOCUMENTS
- PROJECT REVISION:
- TITLE
- DOCUMENT REVISION:
- DESIGN ITEM:
- BOM:
- FAB DWG:
- PCB DWG:
- ASSY DWG:
- SCALE:
- A2
- SIZE
- CAGE CODE
- FILE NAME
- DWG NO.
- SHEET
- OF
- REV

### Library data of the parts
C200 C203 C205 C206 = C: MPN: 06033C104KAT4A; Link: https://www.lcsc.com/product-detail/Multilayer-Ceramic-Capacitors-MLCC-SMD-SMT_Kyocera-AVX-06033C104KAT4A_C2167104.html
C201 C202 C204 C207 = C: MPN: CL10B105KP8NNNC; Link: https://www.lcsc.com/search?q=CL10B105KP8NNNC&s_z=n_CL10B105KP8NNNC
D200 D203 D204 = 1SS416,L3M: Schottky Diode; Manufacturer_Name: Toshiba; MPN: 1SS416,L3M(B; Datasheet Link: https://www.lcsc.com/datasheet/lcsc_datasheet_2410122003_TOSHIBA-1SS416-L3M-B_C2943683.pdf; Height: 0.45mm; LCSC Part Number: C2943683; LCSC Price/Stock: https://www.lcsc.com/product-detail/Schottky-Diodes_TOSHIBA-1SS416-L3M-B_C2943683.html?s_z=n_1SS416,L3M; Arrow Part Number: 1SS416,L3M
  D200: Link: https://www.lcsc.com/product-detail/Schottky-Diodes_TOSHIBA-1SS416-L3M-B_C2943683.html?s_z=n_1SS416,L3M
  D203 D204: Arrow Price/Stock: https://www.lcsc.com/product-detail/Schottky-Diodes_TOSHIBA-1SS416-L3M-B_C2943683.html?s_z=n_1SS416,L3M
D201 D202 D205 D206 = SMF7.0A-TP: TVS Diode (Uni-directional); Datasheet Link: https://www.lcsc.com/datasheet/lcsc_datasheet_2304140030_FTR-SMF7-0A_C707468.pdf; Height: 1.35mm; Manufacturer_Name: FTR; MPN: SMF7.0A; LCSC Part Number: C707468; LCSC Price/Stock: https://www.lcsc.com/product-detail/ESD-and-Surge-Protection-TVS-ESD_FTR-SMF7-0A_C707468.html.; Arrow Part Number: FTR SMF7.0A; Link: https://www.lcsc.com/product-detail/ESD-and-Surge-Protection-TVS-ESD_FTR-SMF7-0A_C707468.html.
IC200 = TLV9064IPWR: Integrated Circuit; Manufacturer_Name: Texas Instruments; Datasheet Link: http://www.ti.com/lit/ds/symlink/tlv9064.pdf; Height: 1.2mm; MPN: TLV9064IPWR; Mouser Part Number: 595-TLV9064IPWR; Mouser Price/Stock: https://www.mouser.co.uk/ProductDetail/Texas-Instruments/TLV9064IPWR?qs=W0yvOO0ixfHY9ZUvwjcceA%3D%3D; Arrow Part Number: TLV9064IPWR; Arrow Price/Stock: https://www.arrow.com/en/products/tlv9064ipwr/texas-instruments?utm_currency=USD&region=nac
J200 = XH2.54-8P: MPN: XY-XH2.54-8A11; Link: https://www.lcsc.com/product-detail/Wire-To-Board-Connector_XYECONN-XY-XH2-54-8A11_C19271374.html?s_z=n_XH2.54%208p
J201 = XH2.54-4P: MPN: BX-XH2.54-4PZZ; Link: https://www.lcsc.com/product-detail/Wire-To-Board-Connector_Bossie-BX-XH2-54-4PZZ_C18077835.html?s_z=n_BX-XH2.54-4PZZ
R200 = R: MPN: 0603WAF3001T5E; Link: https://www.lcsc.com/product-detail/Chip-Resistor-Surface-Mount_UNI-ROYAL-Uniroyal-Elec-0603WAF3001T5E_C4211.html
R201 R203 R205 R210 R215 = R: MPN: 0603WAF1001T5E; Link: https://www.lcsc.com/product-detail/Chip-Resistor-Surface-Mount_UNI-ROYAL-Uniroyal-Elec-0603WAF1001T5E_C21190.html
R202 R206 R211 R216 = R: MPN: 0603WAF3301T5E; Link: https://www.lcsc.com/product-detail/Chip-Resistor-Surface-Mount_UNI-ROYAL-Uniroyal-Elec-0603WAF3301T5E_C22978.html?s_z=n_0603WAF3301T5E
R204 R207 R212 R217 = R: MPN: 0603WAF5601T5E; Link: https://www.lcsc.com/product-detail/Chip-Resistor-Surface-Mount_UNI-ROYAL-Uniroyal-Elec-0603WAF5601T5E_C23189.html
R208 R209 = R: MPN: 0603WAF2202T5E; Link: https://www.lcsc.com/product-detail/Chip-Resistor-Surface-Mount_UNI-ROYAL-Uniroyal-Elec-0603WAF2202T5E_C31850.html?s_z=n_resistor
R213 R214 = R: MPN: RC0603FR-0733KL; Link: https://www.lcsc.com/product-detail/Chip-Resistor-Surface-Mount_YAGEO-RC0603FR-0733KL_C126359.html?s_z=n_resistor

## Sheet High_Power.SchDoc
size 594 x 420 mm; SheetNumber: 3; SheetTotal: 3
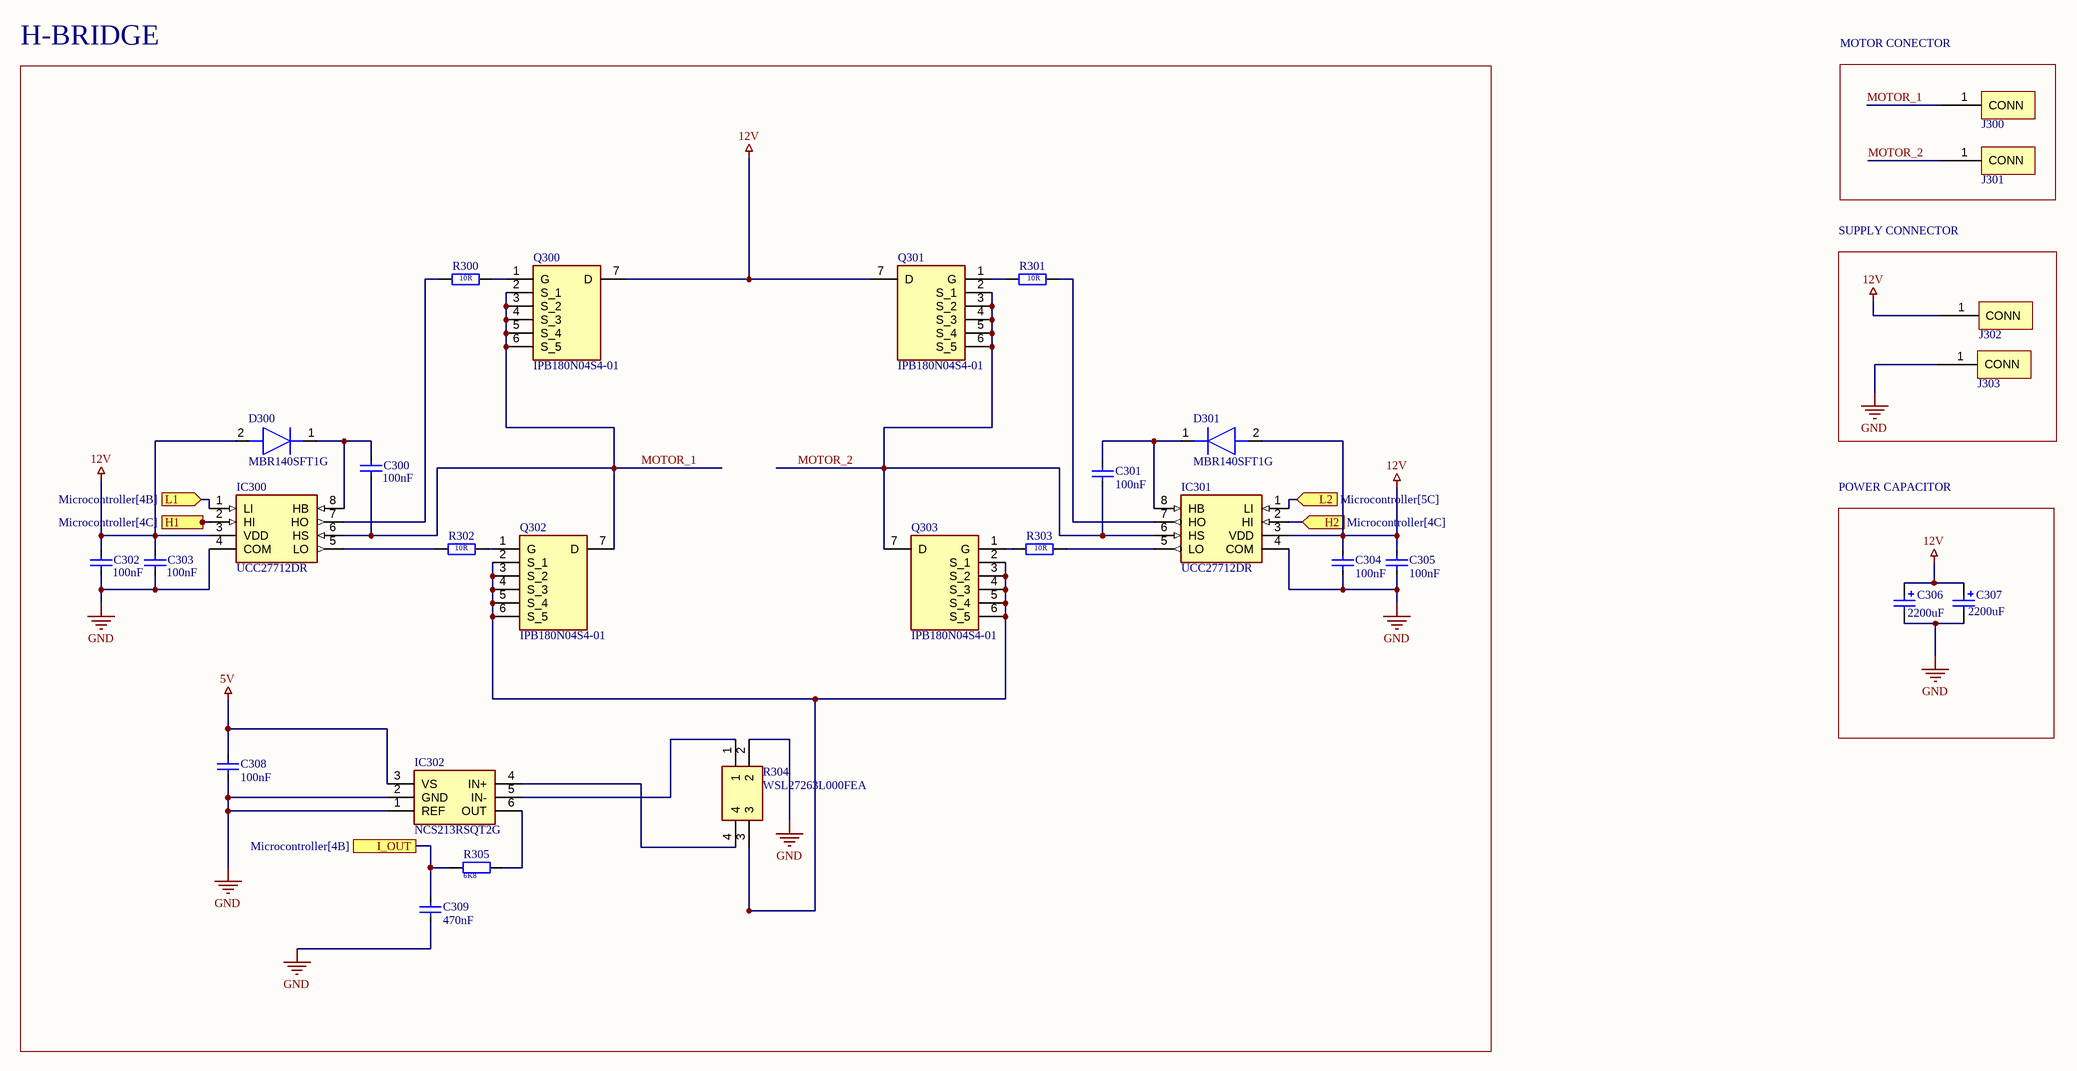
[diagram p3: High_Power.SchDoc]

### Parts
C300  value 100nF  [CAPC1608X09N]  (hidden comment: C)
C301  value 100nF  [CAPC1608X09N]  (hidden comment: C)
C302  value 100nF  [CAPC1608X09N]  (hidden comment: C)
C303  value 100nF  [CAPC1608X09N]  (hidden comment: C)
C304  value 100nF  [CAPC1608X09N]  (hidden comment: C)
C305  value 100nF  [CAPC1608X09N]  (hidden comment: C)
C306  value 2200uF  [Capacitor_12.5_20_5mm]  (hidden comment: Capacitor_12.5_20_5mm)
C307  value 2200uF  [Capacitor_12.5_20_5mm]  (hidden comment: Capacitor_12.5_20_5mm)
C308  value 100nF  [CAPC1608X09N]  (hidden comment: C)
C309  value 470nF  [CAPC1608X09N]  (hidden comment: C)
D300  MBR140SFT1G  [SODFL3616X98N]
D301  MBR140SFT1G  [SODFL3616X98N]
IC300  UCC27712DR  [SOIC127P600X175-8N]
IC301  UCC27712DR  [SOIC127P600X175-8N]
IC302  NCS213RSQT2G  [SOT65P210X110-6N]
J300  PCB_CONN  [T54105100-1050]  (value not drawn)
J301  PCB_CONN  [T54105100-1050]  (value not drawn)
J302  PCB_CONN  [T54105100-1050]  (value not drawn)
J303  PCB_CONN  [T54105100-1050]  (value not drawn)
Q300  IPB180N04S4-01  [IPB240N04S4R9ATMA1]
Q301  IPB180N04S4-01  [IPB240N04S4R9ATMA1]
Q302  IPB180N04S4-01  [IPB240N04S4R9ATMA1]
Q303  IPB180N04S4-01  [IPB240N04S4R9ATMA1]
R300  value 10R  [RESC3216X07N]  (hidden comment: R)
R301  value 10R  [RESC3216X07N]  (hidden comment: R)
R302  value 10R  [RESC3216X07N]  (hidden comment: R)
R303  value 10R  [RESC3216X07N]  (hidden comment: R)
R304  WSL27263L000FEA  [WSL27263L000FEA]
R305  value 6K8  [RESC1608X06N]  (hidden comment: R)

### Blocks framed on the sheet
H-BRIDGE: C300-C305 C308 C309 D300 D301 IC300-IC302 Q300-Q303 R300-R305
MOTOR CONECTOR: J300 J301
SUPPLY CONNECTOR: J302 J303
POWER CAPACITOR: C306 C307

### Ports
H1 (in, see Microcontroller[4C]), H2 (in, see Microcontroller[4C]), I_OUT (see Microcontroller[4B]), L1 (in, see Microcontroller[4B]), L2 (in, see Microcontroller[5C])

### Nets
5V: C308.2 IC302.3(VS)
12V: C302.2 C303.2 C304.2 C305.2 C306.1 C307.1 D300.2(A) D301.2(A) IC300.3(VDD) IC301.3(VDD) J302.1(CONN) Q300.7(D) Q301.7(D)
GND: C302.1 C303.1 C304.1 C305.1 C306.2 C307.2 C308.1 C309.2 IC300.4(COM) IC301.4(COM) IC302.1(REF) IC302.2(GND) J303.1(CONN) R304.2
MOTOR_1: C300.1 IC300.6(HS) J300.1(CONN) Q300.2(S_1) Q300.3(S_2) Q300.4(S_3) Q300.5(S_4) Q300.6(S_5) Q302.7(D)
MOTOR_2: C301.1 IC301.6(HS) J301.1(CONN) Q301.2(S_1) Q301.3(S_2) Q301.4(S_3) Q301.5(S_4) Q301.6(S_5) Q303.7(D)
NetC300_2: C300.2 D300.1(K) IC300.8(HB)
NetC301_2: C301.2 D301.1(K) IC301.8(HB)
NetC309_1: C309.1 R305.2 ; port I_OUT
NetIC101_23: IC300.1(LI) ; port L1
NetIC101_35: IC301.1(LI) ; port L2
NetIC101_37: IC300.2(HI) ; port H1
NetIC101_38: IC301.2(HI) ; port H2
NetIC300_5: IC300.5(LO) R302.1
NetIC300_7: IC300.7(HO) R300.1
NetIC301_5: IC301.5(LO) R303.1
NetIC301_7: IC301.7(HO) R301.1
NetIC302_4: IC302.4(IN+) R304.4
NetIC302_5: IC302.5(IN-) R304.1
NetIC302_6: IC302.6(OUT) R305.1
NetQ300_1: Q300.1(G) R300.2
NetQ301_1: Q301.1(G) R301.2
NetQ302_1: Q302.1(G) R302.2
NetQ302_2: Q302.2(S_1) Q302.3(S_2) Q302.4(S_3) Q302.5(S_4) Q302.6(S_5) Q303.2(S_1) Q303.3(S_2) Q303.4(S_3) Q303.5(S_4) Q303.6(S_5) R304.3
NetQ303_1: Q303.1(G) R303.2

### Notes on the sheet
- DWG NO:
- REV:
- THIS DOCUMENT AND THE DATA DISCLOSED HEREIN OR
- HEREWITH IS THE PROPERTY OF ALTIUM LIMITED AND MAY
- BE FREELY DISTRIBUTED IN WHOLE. NO RIGHTS ARE
- RESERVED OR EXPRESS OR IMPLIED WARANTEE GIVEN.
- REVISION
- DESCRIPTION
- DATE
- APPROVED
- ENG:
- APPROVALS
- PROJECT
- DSN:
- CHK:
- REFERENCE DOCUMENTS
- PROJECT REVISION:
- TITLE
- DOCUMENT REVISION:
- DESIGN ITEM:
- BOM:
- FAB DWG:
- PCB DWG:
- ASSY DWG:
- SCALE:
- A2
- SIZE
- CAGE CODE
- FILE NAME
- DWG NO.
- SHEET
- OF
- REV

### Library data of the parts
C300-C305 C308 = C: MPN: 06033C104KAT4A; Link: https://www.lcsc.com/product-detail/Multilayer-Ceramic-Capacitors-MLCC-SMD-SMT_Kyocera-AVX-06033C104KAT4A_C2167104.html
C306 C307 = Capacitor_12.5_20_5mm: MPN: LKML2001E222MF; Link: https://www.lcsc.com/product-detail/Aluminum-Electrolytic-Capacitors-Leaded_Ymin-LKML2001E222MF_C442841.html?s_z=n_25YXJ2200M12.5X25
C309 = C: MPN: CS1608X7R474K250NRB; Link: https://www.lcsc.com/search?q=Samwha%20Capacitor%20CS1608X7R474K250NRB&s_z=n_Samwha%20Capacitor%20CS1608X7R474K250NRB
D300 D301 = MBR140SFT1G: Diode; Manufacturer_Name: onsemi; Datasheet Link: https://www.lcsc.com/datasheet/lcsc_datasheet_2410121940_onsemi-MBR140SFT1G_C43381.pdf; Height: 0.98mm; MPN: MBR140SFT1G; LCSC Part Number: C43381; LCSC Price/Stock: https://www.lcsc.com/product-detail/Schottky-Diodes_onsemi-MBR140SFT1G_C43381.html?s_z=n_MBR140SFT1G; Arrow Part Number: MBR140SFT1G; Link: https://www.lcsc.com/product-detail/Schottky-Diodes_onsemi-MBR140SFT1G_C43381.html?s_z=n_MBR140SFT1G
IC300 IC301 = UCC27712DR: Integrated Circuit; Manufacturer_Name: Texas Instruments; Datasheet Link: https://www.lcsc.com/datasheet/lcsc_datasheet_2410121944_Texas-Instruments-UCC27712DR_C485818.pdf; Height: 1.75mm; MPN: UCC27712DR; LCSC Part Number: C485818; LCSC Price/Stock: https://www.lcsc.com/product-detail/Gate-Drivers_Texas-Instruments-UCC27712DR_C485818.html?s_z=n_UCC27712DR; Arrow Part Number: UCC27712DR; Link: https://www.lcsc.com/product-detail/Gate-Drivers_Texas-Instruments-UCC27712DR_C485818.html?s_z=n_UCC27712DR
IC302 = NCS213RSQT2G: Integrated Circuit; Manufacturer_Name: onsemi; Datasheet Link: http://www.onsemi.com/pub/Collateral/NCS210R-D.PDF; Height: 1.1mm; MPN: NCS213RSQT2G; LCSC Part Number: 863-NCS213RSQT2G; LCSC Price/Stock: https://www.lcsc.com/product-detail/Current-Sense-Amplifiers_onsemi-NCS213RSQT2G_C603835.html?s_z=n_NCS213RSQT2G; Arrow Part Number: NCS213RSQT2G; Link: https://www.lcsc.com/product-detail/Current-Sense-Amplifiers_onsemi-NCS213RSQT2G_C603835.html?s_z=n_NCS213RSQT2G
J300-J303 = PCB_CONN: Manufacturer: XFCN; MPN: T54105100-1050; Link: https://www.lcsc.com/product-detail/PCB-Welding-Terminal_XFCN-T54105100-1050_C2689193.html?s_z=n_T54105100-1050
Q300-Q303 = IRFS3107-7PPBF: MOSFET (N-Channel); Manufacturer_Name: Infineon Technologies; Datasheet Link: https://www.lcsc.com/datasheet/lcsc_datasheet_2409301305_Infineon-Technologies-IPB180N04S4-01_C536569.pdf; Height: 4mm; MPN: IPB180N04S4-01; LCSC Part Number: C536569; LCSC Price/Stock: https://www.lcsc.com/product-detail/MOSFETs_Infineon-Technologies-IPB180N04S4-01_C536569.html; Arrow Part Number: IPB180N04S4-01; Link: https://www.lcsc.com/product-detail/MOSFETs_Infineon-Technologies-IPB180N04S4-01_C536569.html
R300-R303 = R: MPN: 1206W4F100JT5E; Link: https://www.lcsc.com/product-detail/Chip-Resistor-Surface-Mount_UNI-ROYAL-Uniroyal-Elec-1206W4F100JT5E_C17903.html
R304 = WSL27263L000FEA: Resistor; Manufacturer_Name: Shenzhen Yezhan Elec.; MPN: SBB-K-3J-n-t1; Datasheet Link: https://www.lcsc.com/datasheet/lcsc_datasheet_2411272144_Shenzhen-Yezhan-Elec--SBB-K-3J-n-t1_C503796.pdf; Height: 2.99mm; LCSC Part Number: C503796; LCSC Price/Stock: https://www.lcsc.com/product-detail/Current-Sense-Resistors-Shunt-Resistors_Shenzhen-Yezhan-Elec-SBB-K-3J-n-t1_C503796.html?s_z=n_shunt; Arrow Part Number: WSL27263L000FEA; Link: https://www.lcsc.com/product-detail/Current-Sense-Resistors-Shunt-Resistors_Shenzhen-Yezhan-Elec-SBB-K-3J-n-t1_C503796.html?s_z=n_shunt
R305 = R: MPN: RC0603FR-076K8L; Link: https://www.lcsc.com/product-detail/Chip-Resistor-Surface-Mount_YAGEO-RC0603FR-076K8L_C114632.html?s_z=n_YAGEO%20RC0603FR-076K8L

## Nets that join several sheets
5V: Microcontroller (11 pins), Analog_Signal (C203.2 IC200.4 J200.5), High_Power (C308.2 IC302.3)
8V: Microcontroller (C136.2 IC106.2 LED107.2 R129.2), Analog_Signal (J201.3)
12V: Microcontroller (C135.2 IC104.1 IC106.3), Analog_Signal (R200.2), High_Power (13 pins)
GND: Microcontroller (70 pins), Analog_Signal (23 pins), High_Power (14 pins)
VCC: Microcontroller (31 pins), Analog_Signal (D200.1 J200.6)
NetC200_2: Microcontroller (IC101.20), Analog_Signal (C200.2 D200.2 R200.1 R203.2)
NetC205_2: Microcontroller (IC101.8), Analog_Signal (C205.2 D203.2 R208.1 R213.2)
NetC206_2: Microcontroller (IC101.9), Analog_Signal (C206.2 D204.2 R209.1 R214.2)
NetC309_1: Microcontroller (IC101.17), High_Power (C309.1 R305.2)
NetIC101_21: Microcontroller (IC101.21), Analog_Signal (R202.1 R204.2)
NetIC101_22: Microcontroller (IC101.22), Analog_Signal (R206.1 R207.2)
NetIC101_23: Microcontroller (IC101.23), High_Power (IC300.1)
NetIC101_26: Microcontroller (IC101.26), Analog_Signal (R211.1 R212.2)
NetIC101_27: Microcontroller (IC101.27), Analog_Signal (R216.1 R217.2)
NetIC101_35: Microcontroller (IC101.35), High_Power (IC301.1)
NetIC101_37: Microcontroller (IC101.37), High_Power (IC300.2)
NetIC101_38: Microcontroller (IC101.38), High_Power (IC301.2)